# Altium schematic sheet Classes.SchDoc
size A4
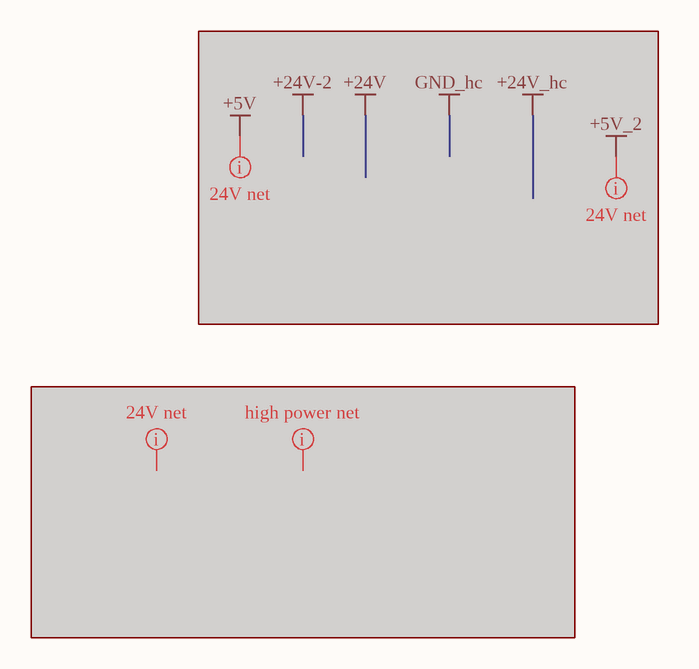
[diagram p0: Classes.SchDoc]

## Layout directives
net class 24V_net: (no net found under the mark)
net class high_power_net: (no net found under the mark)